# EAGLE design Mussol (EAGLE 9.6.1)
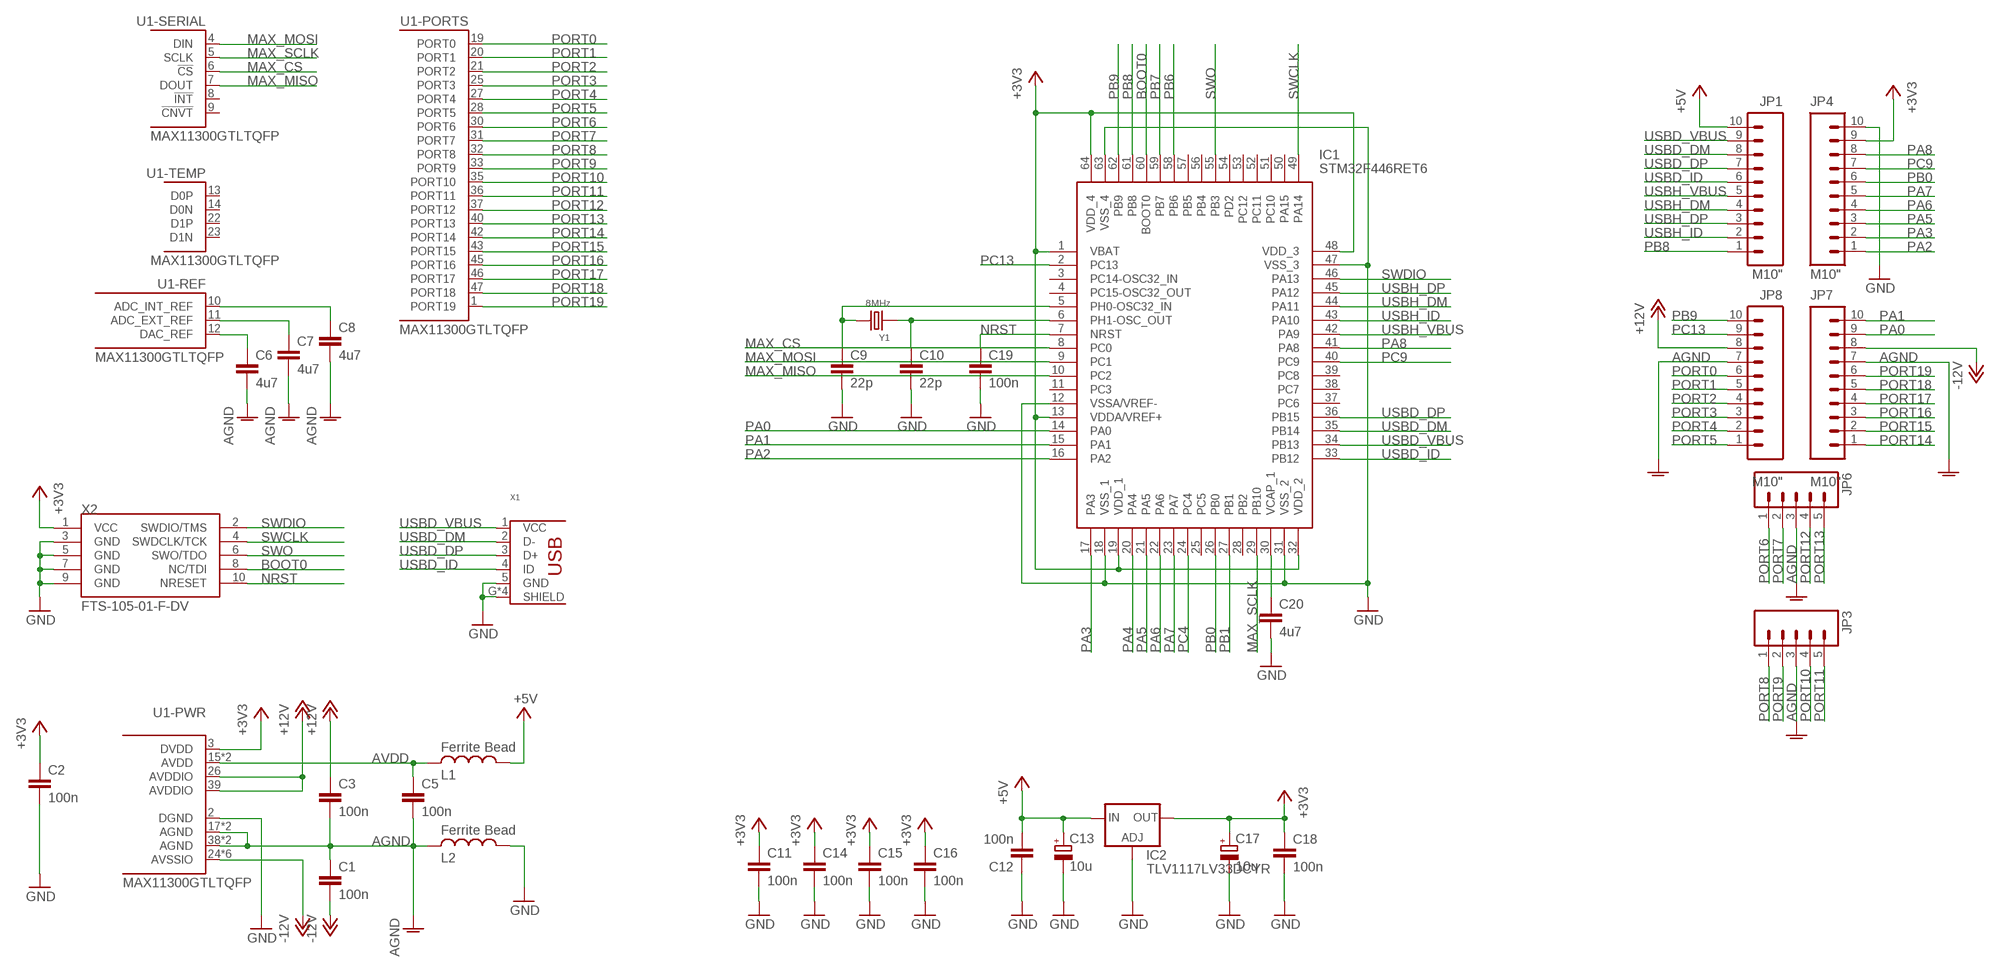
[diagram p0: schematic, sheet 1]

## Parts
C1  100n  C-EUC0402  [C0402]
C2  100n  C-EUC0402  [C0402]
C3  100n  C-EUC0402  [C0402]
C5  100n  C-EUC0402  [C0402]
C6  4u7  C-EUC0603  [C0603]
C7  4u7  C-EUC0603  [C0603]
C8  4u7  C-EUC0603  [C0603]
C9  22p  C-EUC0402  [C0402]
C10  22p  C-EUC0402  [C0402]
C11  100n  C-EUC0402  [C0402]
C12  100n  C-EUC0402  [C0402]
C13  10u  CPOL-EUUD-4X5,8  [UD-4X5,8_NICHICON]
C14  100n  C-EUC0402  [C0402]
C15  100n  C-EUC0402  [C0402]
C16  100n  C-EUC0402  [C0402]
C17  10u  CPOL-EUUD-4X5,8  [UD-4X5,8_NICHICON]
C18  100n  C-EUC0402  [C0402]
C19  100n  C-EUC0402  [C0402]
C20  4u7  C-EUC0603  [C0603]
IC1  STM32F446RET6  [QFP50P1200X1200X160-64N]
IC2  TLV1117LV33DCYR  LD117AS33TR  [SOT223]
JP1  M10"  [1X10]
JP3  M05PTH  [1X05]
JP4  M10"  [1X10]
JP6  M05PTH  [1X05]
JP7  M10"  [1X10]
JP8  M10"  [1X10]
L1  Ferrite Bead  INDUCTOR  [0603]
L2  Ferrite Bead  INDUCTOR  [0603]
U1  MAX11300GTLTQFP  [TQFP48]
X1  USB_HRS_ZX62-B-5PA(11)MICRO.B  [HRS_ZX62RD-AB-5P8]
X2  FTS-105-01-F-DV  ARM_10SMD  [2X5_1.27MM_SMD]
Y1  8MHz  SMD-CRYSTAL-8MHZ-20PF-20PPM(2P-5.0X3.2MM)  [X2-SMD-5.0X3.2X1.3MM]

## Nets
+3V3: C2.1 C11.1 C14.1 C15.1 C16.1 C17.+ C18.1 IC1.1(VBAT) IC1.13(VDDA/VREF+) IC1.19(VDD_1) IC1.32(VDD_2) IC1.48(VDD_3) IC1.64(VDD_4) IC2.4(OUT) JP4.9 U1.3(-PWR:DVDD) X2.1(VCC)
+5V: C12.2 C13.+ IC2.3(IN) JP1.10 L1.1
+12V: C3.1 JP8.8 U1.26(-PWR:AVDDIO) U1.39(-PWR:AVDDIO)
-12V: C1.2 JP7.8 U1.24(-PWR:AVSSIO) U1.29(-PWR:AVSSIO) U1.34(-PWR:AVSSIO) U1.41(-PWR:AVSSIO) U1.44(-PWR:AVSSIO) U1.48(-PWR:AVSSIO)
AGND: C1.1 C3.2 C5.2 C6.2 C7.2 C8.2 JP3.3 JP6.3 JP7.7 JP8.7 L2.2 U1.17(-PWR:AGND) U1.18(-PWR:AGND) U1.38(-PWR:AGND) U1.EP(-PWR:AGND)
AVDD: C5.1 L1.2 U1.15(-PWR:AVDD) U1.16(-PWR:AVDD)
BOOT0: IC1.60(BOOT0) X2.8(NC/TDI)
GND: C2.2 C9.2 C10.2 C11.2 C12.1 C13.- C14.2 C15.2 C16.2 C17.- C18.2 C19.2 C20.2 IC1.12(VSSA/VREF-) IC1.18(VSS_1) IC1.31(VSS_2) IC1.47(VSS_3) IC1.63(VSS_4) IC2.1(ADJ) JP4.10 L2.1 U1.2(-PWR:DGND) X1.5(GND) X1.G2(SHIELD) X1.G3(SHIELD) X1.G4(SHIELD) X1.G(SHIELD) X2.3(GND) X2.5(GND) X2.7(GND) X2.9(GND)
MAX_CS: IC1.8(PC0) U1.6(-SERIAL:!CS!)
MAX_MISO: IC1.10(PC2) U1.7(-SERIAL:DOUT)
MAX_MOSI: IC1.9(PC1) U1.4(-SERIAL:DIN)
MAX_SCLK: IC1.29(PB10) U1.5(-SERIAL:SCLK)
N$1: C8.1 U1.10(-REF:ADC_INT_REF)
N$2: C20.1 IC1.30(VCAP_1)
N$4: C7.1 U1.11(-REF:ADC_EXT_REF)
N$5: C6.1 U1.12(-REF:DAC_REF)
N$12: C10.1 IC1.6(PH1-OSC_OUT) Y1.1
N$15: C9.1 IC1.5(PH0-OSC32_IN) Y1.2
NRST: C19.1 IC1.7(NRST) X2.10(NRESET)
PA0: IC1.14(PA0) JP7.9
PA1: IC1.15(PA1) JP7.10
PA2: IC1.16(PA2) JP4.1
PA3: IC1.17(PA3) JP4.2
PA4: IC1.20(PA4)
PA5: IC1.21(PA5) JP4.3
PA6: IC1.22(PA6) JP4.4
PA7: IC1.23(PA7) JP4.5
PA8: IC1.41(PA8) JP4.8
PB0: IC1.26(PB0) JP4.6
PB1: IC1.27(PB1)
PB6: IC1.58(PB6)
PB7: IC1.59(PB7)
PB8: IC1.61(PB8) JP1.1
PB9: IC1.62(PB9) JP8.10
PC4: IC1.24(PC4)
PC9: IC1.40(PC9) JP4.7
PC13: IC1.2(PC13) JP8.9
PORT0: JP8.6 U1.19(-PORTS:PORT0)
PORT1: JP8.5 U1.20(-PORTS:PORT1)
PORT2: JP8.4 U1.21(-PORTS:PORT2)
PORT3: JP8.3 U1.25(-PORTS:PORT3)
PORT4: JP8.2 U1.27(-PORTS:PORT4)
PORT5: JP8.1 U1.28(-PORTS:PORT5)
PORT6: JP6.1 U1.30(-PORTS:PORT6)
PORT7: JP6.2 U1.31(-PORTS:PORT7)
PORT8: JP3.1 U1.32(-PORTS:PORT8)
PORT9: JP3.2 U1.33(-PORTS:PORT9)
PORT10: JP3.4 U1.35(-PORTS:PORT10)
PORT11: JP3.5 U1.36(-PORTS:PORT11)
PORT12: JP6.4 U1.37(-PORTS:PORT12)
PORT13: JP6.5 U1.40(-PORTS:PORT13)
PORT14: JP7.1 U1.42(-PORTS:PORT14)
PORT15: JP7.2 U1.43(-PORTS:PORT15)
PORT16: JP7.3 U1.45(-PORTS:PORT16)
PORT17: JP7.4 U1.46(-PORTS:PORT17)
PORT18: JP7.5 U1.47(-PORTS:PORT18)
PORT19: JP7.6 U1.1(-PORTS:PORT19)
SWCLK: IC1.49(PA14) X2.4(SWDCLK/TCK)
SWDIO: IC1.46(PA13) X2.2(SWDIO/TMS)
SWO: IC1.55(PB3) X2.6(SWO/TDO)
USBD_DM: IC1.35(PB14) JP1.8 X1.2(D-)
USBD_DP: IC1.36(PB15) JP1.7 X1.3(D+)
USBD_ID: IC1.33(PB12) JP1.6 X1.4(ID)
USBD_VBUS: IC1.34(PB13) JP1.9 X1.1(VCC)
USBH_DM: IC1.44(PA11) JP1.4
USBH_DP: IC1.45(PA12) JP1.3
USBH_ID: IC1.43(PA10) JP1.2
USBH_VBUS: IC1.42(PA9) JP1.5
Unconnected: IC1.3(PC14-OSC32_IN) IC1.4(PC15-OSC32_OUT) IC1.11(PC3) IC1.25(PC5) IC1.28(PB2) IC1.37(PC6) IC1.38(PC7) IC1.39(PC8) IC1.50(PA15) IC1.51(PC10) IC1.52(PC11) IC1.53(PC12) IC1.54(PD2) IC1.56(PB4) IC1.57(PB5) U1.8(-SERIAL:!INT!) U1.9(-SERIAL:!CNVT!) U1.13(-TEMP:D0P) U1.14(-TEMP:D0N) U1.22(-TEMP:D1P) U1.23(-TEMP:D1N)

## Library data of the parts
C1-C3 C5-C12 C14-C16 C18-C20 = Rebel:C-EU: CAPACITOR, European symbol
C13 C17 = Rebel:CPOL-EU: POLARIZED CAPACITOR, European symbol
IC1 = STM32F446RET6:STM32F446RET6: 32-Bit MCU+DSP 512K Flash 180MHz LQFP64 STMicroelectronics STM32F446RET6, 32bit ARM Cortex M4 MCU, 180MHz, 512 kB Flash, 64-Pin LQFP Source: Datasheet <http://docs-emea.rs-online.com/webdocs/14d7/0900766b814d7c59.pdf>; DESCRIPTION: 32-Bit MCU+DSP 512K Flash 180MHz LQFP64 STMicroelectronics STM32F446RET6, 32bit ARM Cortex M4 MCU, 180MHz, 512 kB Flash, 64-Pin LQFP; HEIGHT: 1.6mm; MANUFACTURER_NAME: STMicroelectronics; MANUFACTURER_PART_NUMBER: STM32F446RET6; MOUSER_PART_NUMBER: 511-STM32F446RET6; MOUSER_PRICE-STOCK: https://www.mouser.com/Search/Refine.aspx?Keyword=511-STM32F446RET6; RS_PART_NUMBER: 1106621P; RS_PRICE-STOCK: http://uk.rs-online.com/web/p/products/1106621P
IC2 = v-reg:LD117A?*: Low drop fixed and adjustable positive voltage regulators 1 A Source: http://www.st.com/stonline/products/literature/ds/7194/ld1117axx.pdf
JP1 JP4 JP7 JP8 = SparkFun:M10: Header 10 Standard 10-pin 0.1" header. Use with straight break away headers (SKU : PRT-00116), right angle break away headers (PRT-00553), swiss pins (PRT-00743), machine pins (PRT-00117), and female headers (PRT-00115).
JP3 JP6 = SparkFun:M05: Header 5 Standard 5-pin 0.1" header. Use with straight break away headers (SKU : PRT-00116), right angle break away headers (PRT-00553), swiss pins (PRT-00743), machine pins (PRT-00117), and female headers (PRT-00115). Molex polarized connector foot print use with SKU : PRT-08230 with associated crimp pins and housings.
L1 L2 = Rebel:INDUCTOR; OC_FARNELL: 2288736
U1 = Rebel:MAX11300GTL: 12 BIT ADC / DAC
X1 = Rebel:USB_HRS_ZX62-B-5PA(11)MICRO.B
X2 = borkedlabs-connectors:ARM_10; PACKAGE: 2x5_1.27MM_SMD
Y1 = Seeed-OPL-crystal-osctllator:SMD-CRYSTAL-8MHZ-20PF-20PPM(2P-5.0X3.2MM): 306010004; MPN: 5032/2P; VALUE: 5032/2p

## Net classes
1 power: width 0.178 mm, drill 0.305 mm, clearance 0.178 mm to class 0, clearance 0.178 mm

## Board
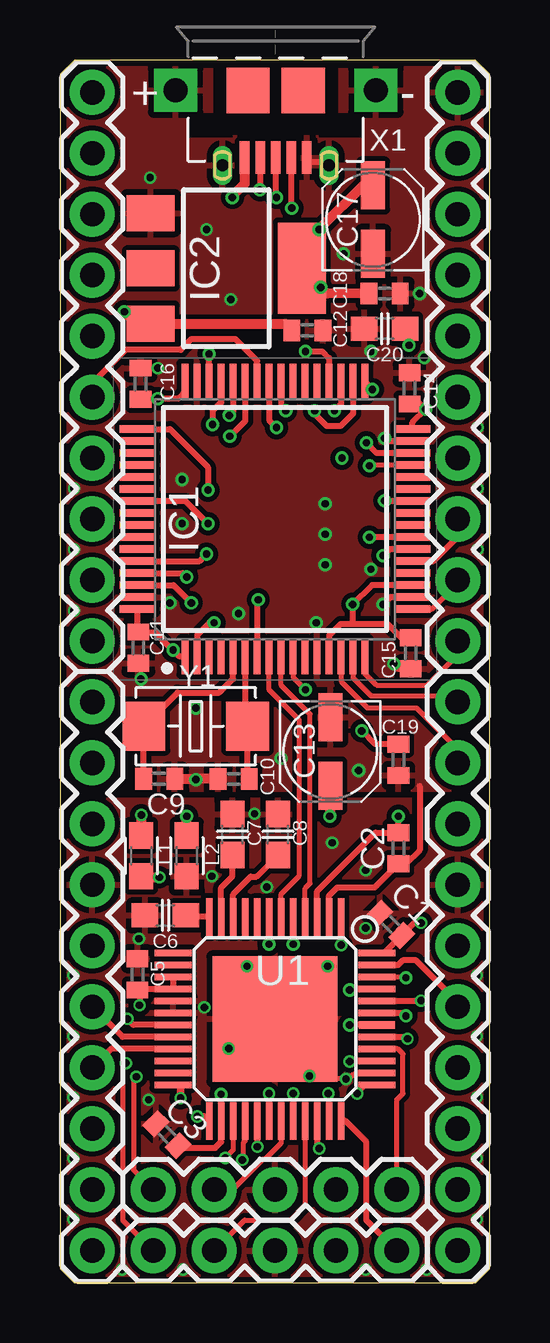
[diagram p1: board, top side]
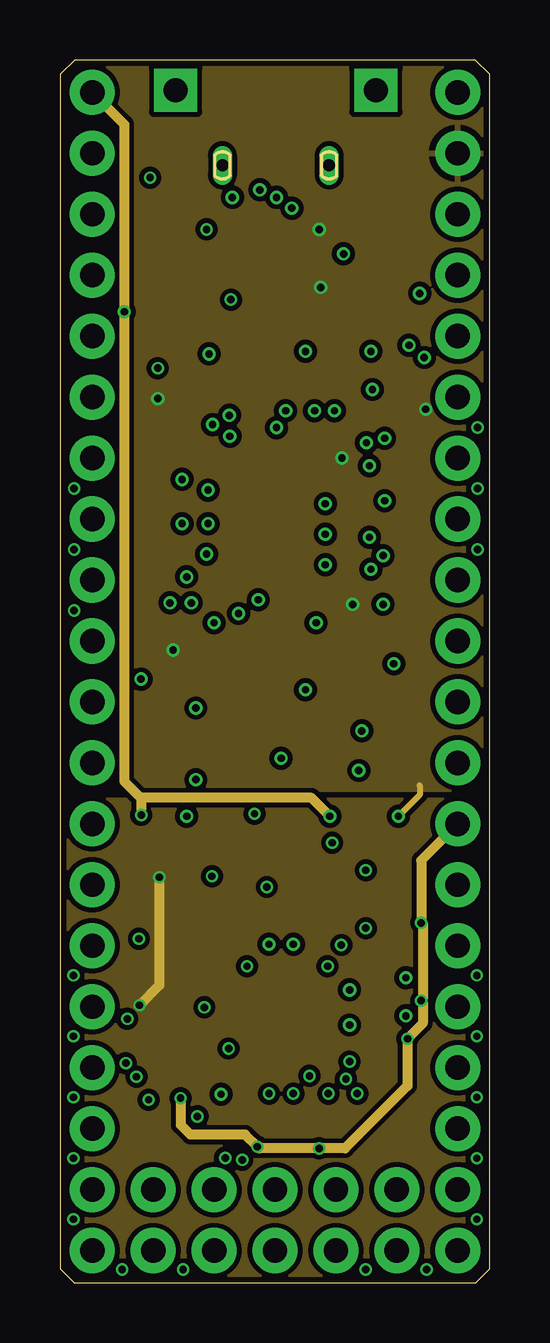
[diagram p2: board, inner layer InnerTop]
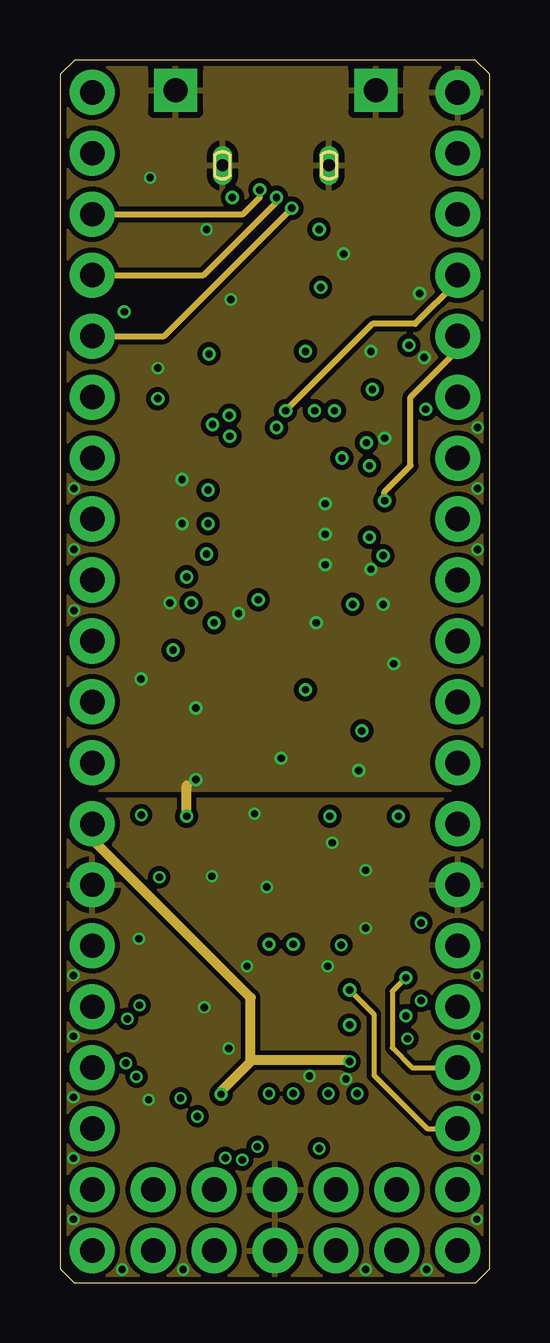
[diagram p3: board, inner layer InnerBottom]
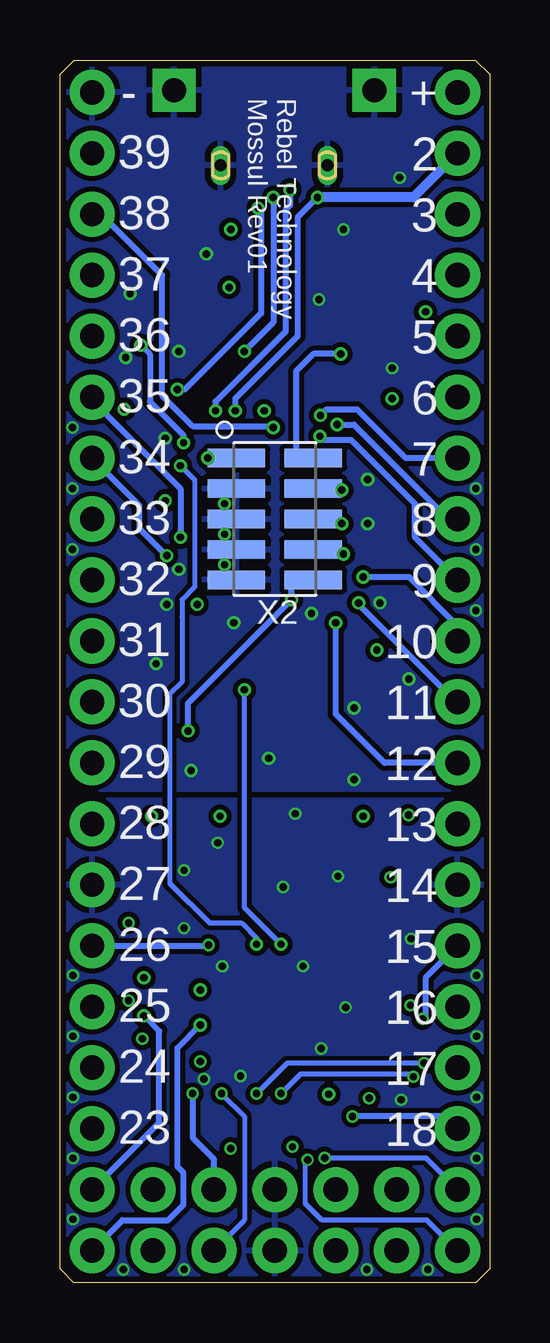
[diagram p4: board, bottom side, seen from below]

Size 17.93 x 50.95 mm. Coordinates in mm from the lower left corner, seen from the top.
Outline: 0,50.35 0,0.58 0.59,0 17.35,0 17.93,0.58 17.93,50.35 17.33,50.95 0.61,50.95 0,50.35
Copper layers (1*2*15*16): Top 0.035mm / dielectric 0.2mm / InnerTop 0.0175mm / dielectric 0.3mm / InnerBottom 0.0175mm / dielectric 0.2mm / Bottom 0.035mm
Design rules "SeeedStudio_4layer_DRU_no_angle_20140221 *": minimum track width 8mil, minimum drill 12mil, track to track 8mil, track to pad 6mil, pad to pad 6mil, via to via 8mil, smd to smd 0mil, copper to edge 10mil, drill to drill 8mil, minimum pad ring 6mil, minimum via ring 4mil, stop-mask expansion 4mil, vias tented up to drill 25mil, thermal gap 10mil

### Footprints (pad centres in the part's own frame; a part is rotated, then mirrored left to right if it is on the bottom)
C0402 = smd 0.7 x 0.9: 1 -0.65,0; 2 0.65,0
C0603 = smd 1.1 x 1: 1 -0.85,0; 2 0.85,0
UD-4X5,8_NICHICON = smd 2 x 1: + 1.425,0; - -1.425,0
QFP50P1200X1200X160-64N = smd 1.475 x 0.3: 1 -5.738,3.75; 2 -5.738,3.25; 3 -5.738,2.75; 4 -5.738,2.25; 5 -5.738,1.75; 6 -5.738,1.25; 7 -5.738,0.75; 8 -5.738,0.25; 9 -5.738,-0.25; 10 -5.738,-0.75; 11 -5.738,-1.25; 12 -5.738,-1.75; 13 -5.738,-2.25; 14 -5.738,-2.75; 15 -5.738,-3.25; 16 -5.738,-3.75; 33 5.738,-3.75; 34 5.738,-3.25; 35 5.738,-2.75; 36 5.738,-2.25; 37 5.738,-1.75; 38 5.738,-1.25; 39 5.738,-0.75; 40 5.738,-0.25; 41 5.738,0.25; 42 5.738,0.75; 43 5.738,1.25; 44 5.738,1.75; 45 5.738,2.25; 46 5.738,2.75; 47 5.738,3.25; 48 5.738,3.75 | smd 0.3 x 1.475: 17 -3.75,-5.738; 18 -3.25,-5.738; 19 -2.75,-5.738; 20 -2.25,-5.738; 21 -1.75,-5.738; 22 -1.25,-5.738; 23 -0.75,-5.738; 24 -0.25,-5.738; 25 0.25,-5.738; 26 0.75,-5.738; 27 1.25,-5.738; 28 1.75,-5.738; 29 2.25,-5.738; 30 2.75,-5.738; 31 3.25,-5.738; 32 3.75,-5.738; 49 3.75,5.738; 50 3.25,5.738; 51 2.75,5.738; 52 2.25,5.738; 53 1.75,5.738; 54 1.25,5.738; 55 0.75,5.738; 56 0.25,5.738; 57 -0.25,5.738; 58 -0.75,5.738; 59 -1.25,5.738; 60 -1.75,5.738; 61 -2.25,5.738; 62 -2.75,5.738; 63 -3.25,5.738; 64 -3.75,5.738
SOT223 = smd 1.5 x 2: 1 -2.3,-3.15; 2 0,-3.15; 3 2.3,-3.15 | smd 3.8 x 2: 4 0,3.15
1X10 = drill 1.016 pad 1.88: 1 0,0; 2 2.54,0; 3 5.08,0; 4 7.62,0; 5 10.16,0; 6 12.7,0; 7 15.24,0; 8 17.78,0; 9 20.32,0; 10 22.86,0
1X05 = drill 1.016 pad 1.88: 1 0,0; 2 2.54,0; 3 5.08,0; 4 7.62,0; 5 10.16,0
0603 = smd 1.1 x 1: 1 -0.85,0; 2 0.85,0
TQFP48 = smd 0.27 x 1.55: 1 -2.75,-4.25; 2 -2.25,-4.25; 3 -1.75,-4.25; 4 -1.25,-4.25; 5 -0.75,-4.25; 6 -0.25,-4.25; 7 0.25,-4.25; 8 0.75,-4.25; 9 1.25,-4.25; 10 1.75,-4.25; 11 2.25,-4.25; 12 2.75,-4.25; 25 2.75,4.25; 26 2.25,4.25; 27 1.75,4.25; 28 1.25,4.25; 29 0.75,4.25; 30 0.25,4.25; 31 -0.25,4.25; 32 -0.75,4.25; 33 -1.25,4.25; 34 -1.75,4.25; 35 -2.25,4.25; 36 -2.75,4.25 | smd 1.55 x 0.27: 13 4.25,-2.75; 14 4.25,-2.25; 15 4.25,-1.75; 16 4.25,-1.25; 17 4.25,-0.75; 18 4.25,-0.25; 19 4.25,0.25; 20 4.25,0.75; 21 4.25,1.25; 22 4.25,1.75; 23 4.25,2.25; 24 4.25,2.75; 37 -4.25,2.75; 38 -4.25,2.25; 39 -4.25,1.75; 40 -4.25,1.25; 41 -4.25,0.75; 43 -4.25,-0.25; 44 -4.25,-0.75; 45 -4.25,-1.25; 46 -4.25,-1.75; 47 -4.25,-2.25; 48 -4.25,-2.75 | smd 1.5 x 0.3: 42 -4.25,0.25 | smd 5.22 x 5.22: EP 0,0
HRS_ZX62RD-AB-5P8 = smd 0.4 x 1.35: 1 1.3,2.275; 2 0.65,2.275; 3 0,2.275; 4 -0.65,2.275; 5 -1.3,2.275 | smd 1.8 x 1.9: D_0 -1.15,-0.525; D_1 1.15,-0.525 | drill 1 pad 1.8 square: G -4.175,-0.525; G2 4.175,-0.525 | drill 0.5 long: G3 -2.225,2.6; G4 2.225,2.6
2X5_1.27MM_SMD = smd 2.4 x 0.76: 1 -1.6,2.54; 2 1.6,2.54; 3 -1.6,1.27; 4 1.6,1.27; 5 -1.6,0; 6 1.6,0; 7 -1.6,-1.27; 8 1.6,-1.27; 9 -1.6,-2.54; 10 1.6,-2.54
X2-SMD-5.0X3.2X1.3MM = smd 1.778 x 2.032: 1 -2.159,0; 2 2.159,0

### Placement (x,y rotation side)
C1  13.8,14.94 315 top
C2  14.11,18.11 270 top
C3  4.46,6.17 135 top
C5  3.24,12.85 90 top
C6  4.4,15.32 180 top
C7  7.19,18.68 90 top
C8  9.1,18.68 90 top
C9  4.14,21 0 top
C10  7.25,21 180 top
C11  3.27,26.47 270 top
C12  10.31,39.69 180 top
C13  11.27,22.14 270 top
C14  14.58,37.27 90 top
C15  14.63,26.23 270 top
C16  3.36,37.47 90 top
C17  13.06,44.3 90 top
C18  13.54,41.22 0 top
C19  14.11,21.79 270 top
C20  13.54,39.76 180 top
IC1  8.97,31.83 90 top
IC2  6.94,42.27 270 top
JP1  1.35,26.75 90 top
JP3  3.89,1.35 0 top
JP4  16.59,26.75 90 top
JP6  3.89,3.89 0 top
JP7  16.59,1.35 90 top
JP8  1.35,1.35 90 top
L1  3.38,17.79 270 top
L2  5.29,17.79 270 top
U1  8.97,11 180 top
X1  9,49.16 180 top
X2  8.97,31.83 0 bottom
Y1  5.66,23.19 180 top

### Tracks (layer width: path | path; a pad name or v marks a point on that pad's centre or on a via)
+3V3  (via drill 0.3 pad 0.55)
  Top 0.254: IC1.13 11.22,26.96 11.7,27.45 12.21,27.45 | IC1.1 4.99,26.09 v4.72,26.37 4.7,26.37 3.95,27.12 C11.1 3.23,27.16 IC1.64 | IC1.32 14.71,35.85 v15.26,36.4 14.94,36.72 C14.1 | C16.1 3.39,36.84 v4.08,36.84 4.94,36.84 5.22,37.12 IC1.48 | U1.3 10.72,16.32 13.16,18.76 C2.1 v14.11,19.44 | 12.21,27.45 13.67,27.45 14.23,26.88 C15.1 | IC1.19 13.01,29.08 v12.21,28.27 12.21,27.45
  Top 0.406: v10.87,41.49 IC2.4 10.09,43.68 10.6,43.68 v10.81,43.89 12.65,45.73 C17.+ | v10.87,41.49 v10.87,41.48 | C18.1 11.15,41.21 v10.87,41.49
  InnerTop 0.254: v14.11,19.44 15,20.33 15,20.71
  Bottom 0.254: v11.76,34.37 X2.1
  pour InnerTop: -2.46,53.42 19.13,53.42 19.13,20.52 -2.46,20.52
+5V  (via drill 0.3, 0.3 pad 0.55)
  Top 0.406: v2.68,40.46 3.17,39.97 IC2.3 3.82,39.94 9.41,39.94 C12.2 | v3.39,19.49 3.39,18.66 L1.1 | C13.+ 11.26,20.7 v11.26,19.44
  InnerTop 0.406: JP1.10 2.68,48.27 v2.68,40.46 2.68,20.9 3.46,20.13 3.39,20.07 | 3.39,20.07 v3.39,19.49 | 3.39,20.07 3.39,20.21 10.49,20.21 v11.26,19.44
+12V  (via drill 0.3, 0.3 pad 0.55)
  Top 0.254: C3.1 5.01,5.62 6.47,5.62 6.72,5.87 U1.26 v6.72,7.86 | U1.39 12.11,9.25 v12.08,9.22
  InnerBottom 0.254: v6.72,7.86 6.75,7.89
  InnerBottom 0.406: 7.95,9.28 7.95,9.22 6.75,8.01 6.75,7.89 | 7.95,9.28 7.95,11.89 1.35,18.49 JP8.8 | v12.08,9.22 12.02,9.28 7.95,9.28
-12V  (via drill 0.3)
  Top 0.203: 14.42,10.25 v14.49,10.17
  Top 0.254: U1.29 8.22,5.65 v8.24,5.67 | U1.34 10.72,5.69 v10.81,5.6 | U1.41 14.42,10.25 | U1.48 13.53,13.75 C1.2 14.78,15 v15.07,15 | U1.44 15.05,11.75 v15.07,11.76 | U1.24 4.97,8.25 5.04,8.18
  Top 0.305: 5.04,8.18 5.04,7.82 5.03,7.81 v5.03,7.7
  InnerTop 0.406: JP7.8 15.07,17.6 v15.07,15 15.13,15 15.13,11.82 v15.07,11.76 15.13,11.7 15.13,10.81 v14.49,10.17 14.49,8.2 11.89,5.6 v10.81,5.6 8.3,5.6 v8.24,5.67 7.73,6.18 5.44,6.18 5.03,6.59 v5.03,7.7
AGND  (via drill 0.3)
  Top 0.203: U1.38 12.43,8.75 12.37,8.68 12.24,8.68 12.05,8.49 v11.93,8.49 11.42,8.49
  other vias: 3.7,7.63 10.4,8.62 7.04,9.76 7.8,13.19 11.36,18.34 8.62,16.5 12.75,17.19 6.34,16.94 8.12,19.54 12.75,14.78 3.29,14.34 0.56,10.27 0.56,7.73 0.56,5.19 0.56,2.65 2.59,0.56 0.56,12.81 5.13,0.56 12.75,0.56 15.29,0.56 17.39,2.65 17.39,5.19 17.39,7.73 17.39,10.27 17.39,12.81 6.02,11.48 11.16,13.19
  pour InnerBottom: -1.19,20.14 19.13,20.14 19.13,-1.19 -1.19,-1.19
  pour Top: -3.73,20.14 19.13,20.14 19.13,-1.19 -3.73,-1.19
  pour Bottom: 0.08,20.14 19.13,20.14 19.13,-1.19 0.08,-1.19
AVDD  (via drill 0.3)
  Top 0.254: U1.15 U1.16 3.28,12.25 C5.1 3.32,12.12 v3.32,11.57
  Top 0.406: L1.2 3.42,16.9 v4.14,16.9
  InnerTop 0.406: v4.14,16.9 4.14,12.4 v3.32,11.57
  pour InnerTop: -2.46,20.14 19.13,20.14 19.13,-1.19 -2.46,-1.19
BOOT0  (via drill 0.3 pad 0.55)
  Top 0.254: IC1.60 5.82,30.08 v6.11,30.37
  Bottom 0.254: X2.8 6.3,30.56 v6.11,30.37
GND  (via drill 0.3, 0.3 pad 0.55)
  Top 0.254: X1.5 10.49,46.7 11.09,46.7 X1.G3 | U1.2 11.22,16.14 11.55,16.47 13.12,16.47 C2.2 14.43,17.46 15,18.03 15,20.7 | IC1.18 13.78,28.58 v13.48,28.27 | IC1.31 13.66,35.08 v13.54,35.19 | C15.2 14.13,25.58 v13.92,25.79
  Top 0.406: L2.1 v5.29,19.44 | C9.2 5.63,21 5.64,21 | 5.64,21 v5.67,20.97 | C10.2 5.64,21
  InnerBottom 0.406: v5.29,19.44 5.29,20.71
  other vias: 4.08,38.11 6.11,43.89 7.13,40.97 12.46,21.35 10.68,27.51 3.38,25.16 15.19,38.56 4.59,28.33 7.45,27.89 12.97,29.73 5.1,31.64 5.1,33.48 9.22,21.86 11.83,42.88 12.97,38.81 5.67,23.95 15,41.22 3.76,46.05 11.07,31.19 11.07,32.46 11.07,29.92 0.59,30.56 0.59,33.1 0.59,28.02 17.42,35.64 17.42,33.1 17.42,30.56
  pour InnerBottom: -1.19,53.42 19.13,53.42 19.13,20.52 -1.19,20.52
  pour Top: -3.73,53.42 19.13,53.42 19.13,20.52 -3.73,20.52
  pour Bottom: 0.08,53.42 19.13,53.42 19.13,20.52 0.08,20.52
MAX_CS
  Top 0.203: U1.6 9.22,16.2 9.99,16.97 9.99,23.44 8.72,24.71 IC1.8
MAX_MISO  (via drill 0.3 pad 0.55)
  Top 0.203: IC1.10 9.72,25.23 v10.24,24.71
  Top 0.254: U1.7 v8.72,14.11
  Bottom 0.203: v8.72,14.11 10.24,15.63 v10.24,24.71
MAX_MOSI
  Top 0.203: U1.4 10.22,16.44 10.43,16.65 10.43,23.7 9.22,24.91 IC1.9
MAX_SCLK  (via drill 0.3 pad 0.55)
  Top 0.203: IC1.29 12.93,34.08 v12.91,34.05 | v9.73,14.11 9.73,15.24 U1.5
  Bottom 0.203: v12.91,34.05 12.32,33.46 12.32,29 12.84,28.47 12.84,27.74 12.84,25.03 13.35,24.52 13.35,16.65 11.7,15 10.37,15 9.73,14.36 v9.73,14.11
N$1
  Top 0.254: U1.10 7.22,16.19 7.96,16.93 8.19,16.93 C8.1
N$2  (via drill 0.3 pad 0.55)
  Top 0.254: C20.1 14.44,39.18 v14.56,39.07 | IC1.30 13.2,34.58 v12.78,35
  Bottom 0.254: v14.56,39.07 14.18,38.68 14.18,36.72 12.78,35.32 v12.78,35
N$4
  Top 0.254: U1.11 6.72,16.47 7.19,16.94 C7.1
N$5
  Top 0.254: U1.12 5.32,15.25 C6.1
N$12
  Top 0.254: IC1.6 7.72,23.3 Y1.1 7.82,21.07 C10.1
N$15
  Top 0.254: C9.1 3.49,23.18 Y1.2 4.9,24.59 6.64,24.59 7.22,25.17 IC1.5
NRST  (via drill 0.3 pad 0.55)
  Top 0.254: v8.27,28.46 8.22,28.41 IC1.7 | C19.1 13.15,22.44 v12.59,23
  Bottom 0.254: v12.59,23 12.59,24.14 v8.27,28.46 8.27,28.97 7.95,29.29 X2.10
PA0
  Top 0.203: IC1.14 11.72,25.08 12.84,23.95 14.87,23.95 16.59,22.24 JP7.9
PA1
  Top 0.203: JP7.10 16.34,24.46 12.97,24.46 12.22,25.21 IC1.15
PA2
  Top 0.203: IC1.16 12.72,25.39 13.2,24.9 15.32,24.9 16.59,26.18 JP4.1
PA3
  Top 0.203: IC1.17 15.51,28.08 16.59,29.16 JP4.2
PA5
  Top 0.254: IC1.21 15.57,30.08 16.59,31.09 JP4.3
PA6  (via drill 0.3 pad 0.55)
  Top 0.254: IC1.22 13.75,30.58 v13.48,30.3
  Bottom 0.254: v13.48,30.3 14.62,31.45 14.62,32.4 JP4.4
PA7  (via drill 0.3 pad 0.55)
  Top 0.254: v12.91,31.06 14.7,31.06 IC1.23
  Bottom 0.254: JP4.5 16.59,36.78 12.91,33.1 v12.91,31.06
PA8  (via drill 0.3 pad 0.55)
  Top 0.254: IC1.41 8.72,35.95 v9.03,35.64
  Bottom 0.254: v9.03,35.64 9.1,35.7 12.4,35.7 13.67,36.97 13.67,41.99 16.21,44.53 JP4.8
PB0  (via drill 0.3 pad 0.55)
  Top 0.254: IC1.26 13.55,32.58 v13.54,32.59
  InnerBottom 0.254: v13.54,32.59 13.54,32.97 14.62,34.05 14.62,36.91 16.59,38.87 JP4.6
PB8  (via drill 0.3 pad 0.55)
  Top 0.254: IC1.61 5.12,29.58 v5.29,29.41
  Bottom 0.254: v5.29,29.41 3.38,29.41 1.35,27.38 JP1.1
PB9  (via drill 0.3 pad 0.55)
  Top 0.254: IC1.62 4.73,29.08 v5.48,28.33
  Bottom 0.254: JP8.10 1.41,24.21 5.48,28.27 v5.48,28.33
PC9  (via drill 0.3 pad 0.55)
  Top 0.254: IC1.40 9.22,36.53 v9.41,36.33
  InnerBottom 0.254: JP4.7 16.59,41.73 14.81,39.95 13.03,39.95 v9.41,36.33
PC13  (via drill 0.3 pad 0.55)
  Top 0.254: v6.43,27.51 6.24,27.51 5.72,26.99 IC1.2
  Bottom 0.254: JP8.9 4.4,21.67 6.43,23.7 v6.43,27.51
PORT0  (via drill 0.3)
  Top 0.254: U1.19 3.06,10.75 v2.81,11
  Bottom 0.254: JP8.6 2.68,12.71 2.68,11.13 v2.81,11
PORT1
  Top 0.254: U1.20 2.61,10.25 JP8.5
PORT2
  Top 0.254: U1.21 2.13,9.75 JP8.4
PORT3  (via drill 0.3)
  Top 0.254: U1.25 6.03,6.93 v5.73,6.93
  Bottom 0.254: JP8.3 1.86,6.93 v5.73,6.93
PORT4  (via drill 0.3)
  Top 0.203: U1.27 7.22,5.53 v6.89,5.2
  Bottom 0.203: v6.89,5.2 2.67,5.2 JP8.2
PORT5  (via drill 0.3)
  Top 0.203: v7.6,5.12 7.64,5.16 7.64,5.84 7.72,5.92 U1.28
  Bottom 0.203: JP8.1 2.62,2.62 7,2.62 7.71,3.33 7.71,5.02 v7.6,5.12
PORT6  (via drill 0.3)
  Top 0.203: JP6.1 3.06,4.71 3.06,8.46 v3.19,8.59
  Top 0.254: U1.30 v8.72,7.88 v8.72,7.89
  Bottom 0.203: v3.19,8.59 3.32,8.71 7.89,8.71 v8.72,7.89
PORT7
  Top 0.203: U1.31 9.22,5.83 8.55,5.16 8.46,5.16 7.19,3.89 JP6.2
PORT8  (via drill 0.3)
  Top 0.203: JP3.1 2.62,2.62 2.62,9.03 v2.75,9.16 | v9.73,7.89 9.73,6.76 U1.32
  Bottom 0.203: v2.75,9.16 8.46,9.16 v9.73,7.89
PORT9
  Top 0.203: JP3.2 7.7,2.62 9.6,2.62 10.24,3.25 10.24,6.73 U1.33
PORT10  (via drill 0.3)
  Top 0.203: U1.35 11.22,7.89 v11.19,7.89
  Bottom 0.203: v11.19,7.89 10.24,6.93 10.24,2.62 JP3.4
PORT11
  Top 0.254: JP3.5 12.78,2.62 12.78,5.88 11.91,6.75 U1.36
PORT12  (via drill 0.3)
  Top 0.254: v12.4,7.89 12.4,7.94 12.71,8.25 U1.37
  Bottom 0.254: JP6.4 11.51,5.16 12.4,6.05 v12.4,7.89
PORT13
  Top 0.203: JP6.5 14.05,7.63 14.3,7.89 14.3,9.54 14.09,9.75 U1.40
PORT14  (via drill 0.3 pad 0.55)
  Top 0.254: v12.08,10.74 U1.42
  Bottom 0.254: JP7.1 15.32,2.62 13.41,2.62 12.78,3.25 12.78,4.58 13.03,4.84 13.03,9.79 v12.08,10.74
PORT15  (via drill 0.3 pad 0.55)
  Top 0.254: U1.43 14.31,11.25 v14.43,11.13
  Bottom 0.254: JP7.2 13.8,6.68 13.8,10.49 v14.43,11.13
PORT16  (via drill 0.3 pad 0.55)
  Top 0.254: U1.45 12.12,12.25 v12.08,12.21
  InnerBottom 0.203: v12.08,12.21 13.1,11.19 13.1,8.65 15.32,6.43 JP7.3
PORT17  (via drill 0.3 pad 0.55)
  Top 0.203: U1.46 14.4,12.75 v14.43,12.71
  InnerBottom 0.203: v14.43,12.71 13.86,12.14 13.86,9.79 14.68,8.97 JP7.4
PORT18
  Top 0.254: U1.47 14.11,13.25 14.3,13.44 14.85,13.44 16.59,11.7 JP7.5
PORT19  (via drill 0.3)
  Top 0.254: v11.73,14.08 11.72,14.09 U1.1
  Bottom 0.254: JP7.6 11.76,14.05 v11.73,14.08
SWCLK  (via drill 0.3 pad 0.55)
  Top 0.254: IC1.49 4.58,35.58 6.18,33.99 v6.18,33.03
  Bottom 0.254: X2.4 7.31,33.03 v6.18,33.03
SWDIO  (via drill 0.3 pad 0.55)
  Top 0.254: IC1.46 v6.22,38.7
  Bottom 0.254: v6.22,38.7 7.36,38.7 8.08,37.99 8.08,34.37 X2.2
SWO  (via drill 0.3 pad 0.55)
  Top 0.254: v6.18,31.64 5.23,32.58 IC1.55
  Bottom 0.254: X2.6 6.37,31.83 v6.18,31.64
USBD_DM  (via drill 0.3 pad 0.55)
  Top 0.254: X1.2 8.35,45.56 v8.33,45.54 | IC1.35 11.72,36.61 v11.45,36.33
  InnerBottom 0.254: JP1.8 7.64,44.53 8.33,45.22 v8.33,45.54
  Bottom 0.254: v11.45,36.33 11.45,36.72 8.53,39.64 8.53,44.72 8.33,44.91 v8.33,45.54
USBD_DP  (via drill 0.3 pad 0.55)
  Top 0.254: X1.3 9,45.26 v9.03,45.22 | v10.24,38.81 10.94,38.81 11.22,38.53 IC1.36
  InnerBottom 0.254: v9.03,45.22 9.03,45.03 5.98,41.99 JP1.7
  Bottom 0.254: v9.03,45.22 9.03,40.02 v10.24,38.81
USBD_ID  (via drill 0.3 pad 0.55)
  Top 0.254: IC1.33 12.72,37.54 v13.03,37.22 | v9.67,44.78 9.65,44.8 X1.4
  InnerBottom 0.254: JP1.6 4.33,39.45 v9.67,44.78
  Bottom 0.254: v13.03,37.22 12.72,37.22 9.54,40.4 9.54,44.65 v9.67,44.78
USBD_VBUS  (via drill 0.3 pad 0.55)
  Top 0.254: v10.62,36.33 10.62,36.21 11.13,35.7 11.7,35.7 12.22,36.22 IC1.34
  Top 0.406: X1.1 7.7,45.8 7.19,45.29 v7.19,45.22
  Bottom 0.254: v7.19,45.22 8.02,44.4 8.02,39.45 10.62,36.84 v10.62,36.33
  Bottom 0.406: JP1.9 3.19,45.22 v7.19,45.22
USBH_DM  (via drill 0.3 pad 0.55)
  Top 0.254: IC1.44 7.22,36.3 v7.06,36.14
  Bottom 0.254: JP1.4 3.51,34.37 5.54,36.4 6.81,36.4 v7.06,36.14
USBH_DP  (via drill 0.3 pad 0.55)
  Top 0.254: IC1.45 6.72,36.69 6.37,36.33 v6.37,35.76
  Bottom 0.254: JP1.3 1.73,31.83 5.67,35.76 v6.37,35.76
USBH_ID  (via drill 0.3 pad 0.55)
  Top 0.254: IC1.43 7.72,35.91 v7.08,35.28
  Bottom 0.254: JP1.2 3.13,31.06 3.13,32.46 5.79,35.13 6.94,35.13 v7.08,35.28
USBH_VBUS
  Top 0.254: IC1.42 8.22,38.42 7.32,39.32 5.48,39.32 5.03,38.87 2.75,38.87 1.35,37.48 JP1.5

### Text on the board
tPlace: + | -
bPlace: + | Rebel Technology / Mossul Rev01 | - | 2 | 39 | 3 | 38 | 4 | 37 | 5 | 36 | 6 | 35 | 7 | 34 | 8 | 33 | 9 | 32 | 10 | 31 | 11 | 30 | 12 | 29 | 13 | 28 | 14 | 27 | 15 | 26 | 16 | 25 | 17 | 24 | 18 | 23